# Altium schematic sheet 01 REVISION HISTORY.SchDoc
size 420 x 297 mm
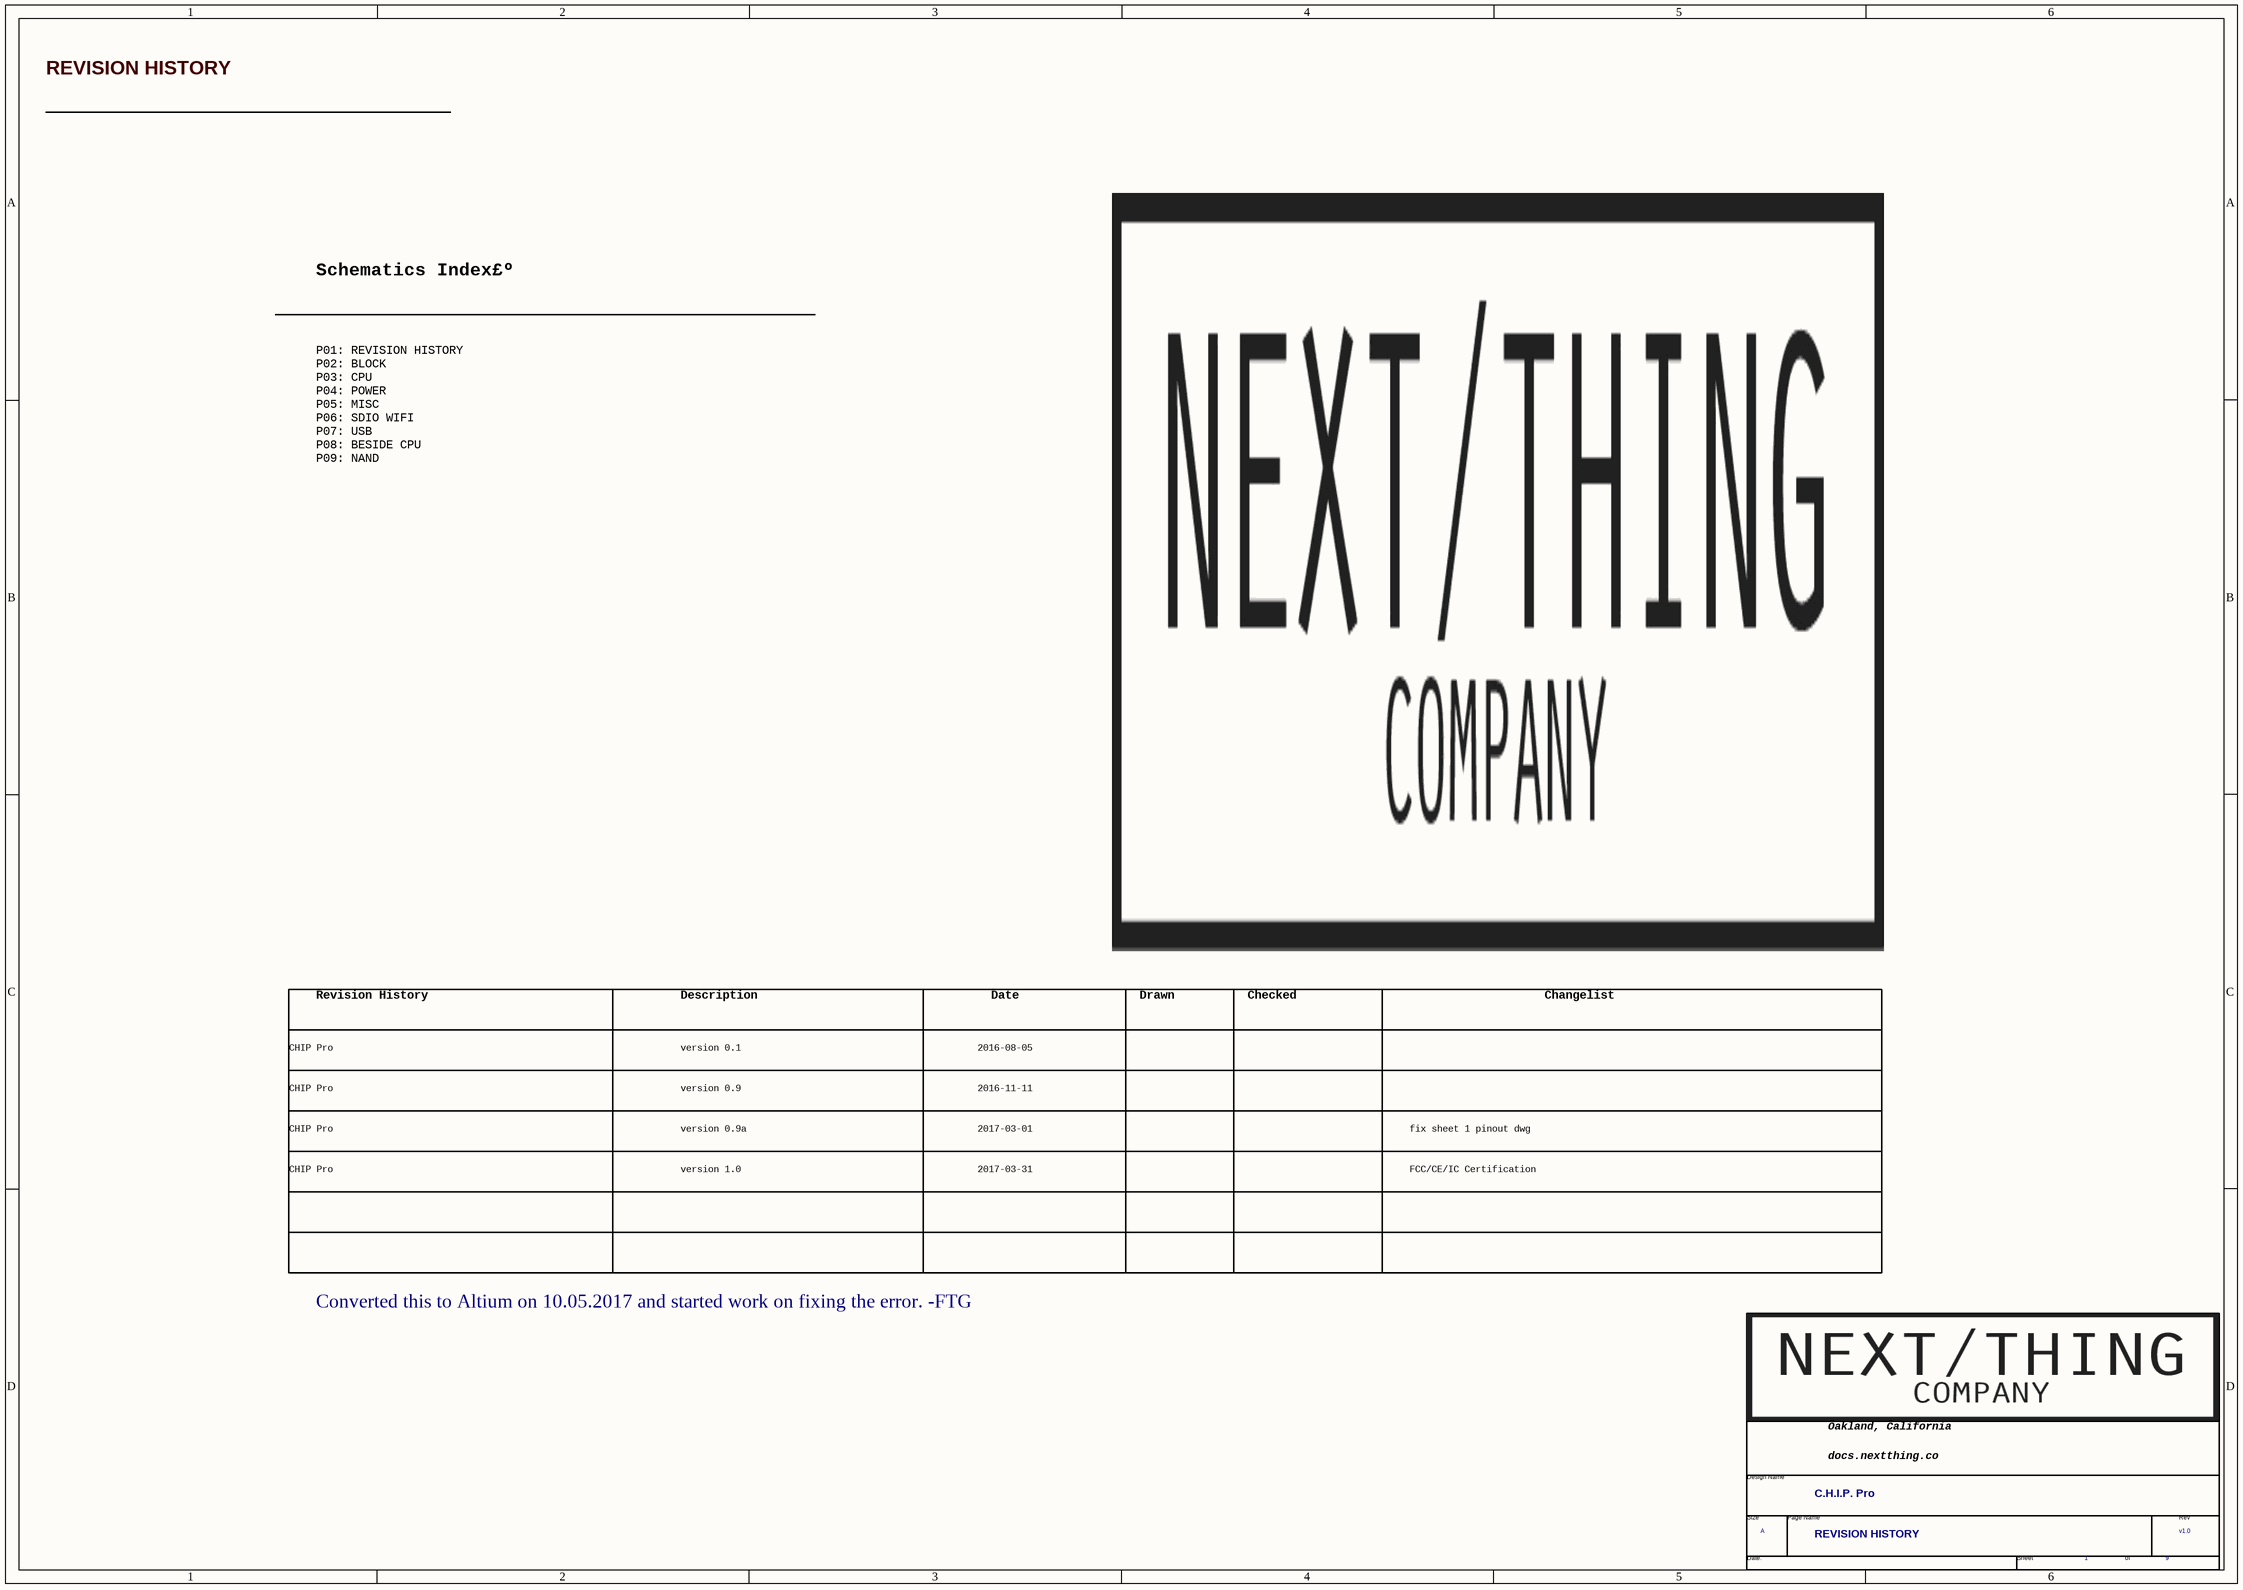
[diagram p0: 01 REVISION HISTORY.SchDoc]

## Parts
*  Page Count: 9  Page Number: 1  Page Size: A  Title: C.H.I.P. Pro  RevCode: v1.0  Doc: REVISION HISTORY  (hidden comment: TitleBlock1-nextthing)  (graphical)

## Notes on the sheet
- REVISION HISTORY
- Schematics Index£º
- P01: REVISION HISTORY
  P02: BLOCK
  P03: CPU
  P04: POWER
  P05: MISC
  P06: SDIO WIFI
  P07: USB
  P08: BESIDE CPU
  P09: NAND
- Revision History
- Description
- Date
- Drawn
- Checked
- Changelist
- CHIP Pro
- version 0.1
- 2016-08-05
- version 0.9
- version 0.9a
- 2016-11-11
- 2017-03-01
- fix sheet 1 pinout dwg
- version 1.0
- 2017-03-31
- FCC/CE/IC Certification
- Converted this to Altium on 10.05.2017 and started work on fixing the error. -FTG
- (in symbol TitleBlock1-nextthing) Oakland, California; Design Name; docs.nextthing.co /; Size; Page Name; Rev; Date:; Sheet; of

## Library data of the parts
* = TitleBlock1-nextthing: Page Create Date: March  8, 1995